# Altium schematic sheet cpu.SchDoc
size A4
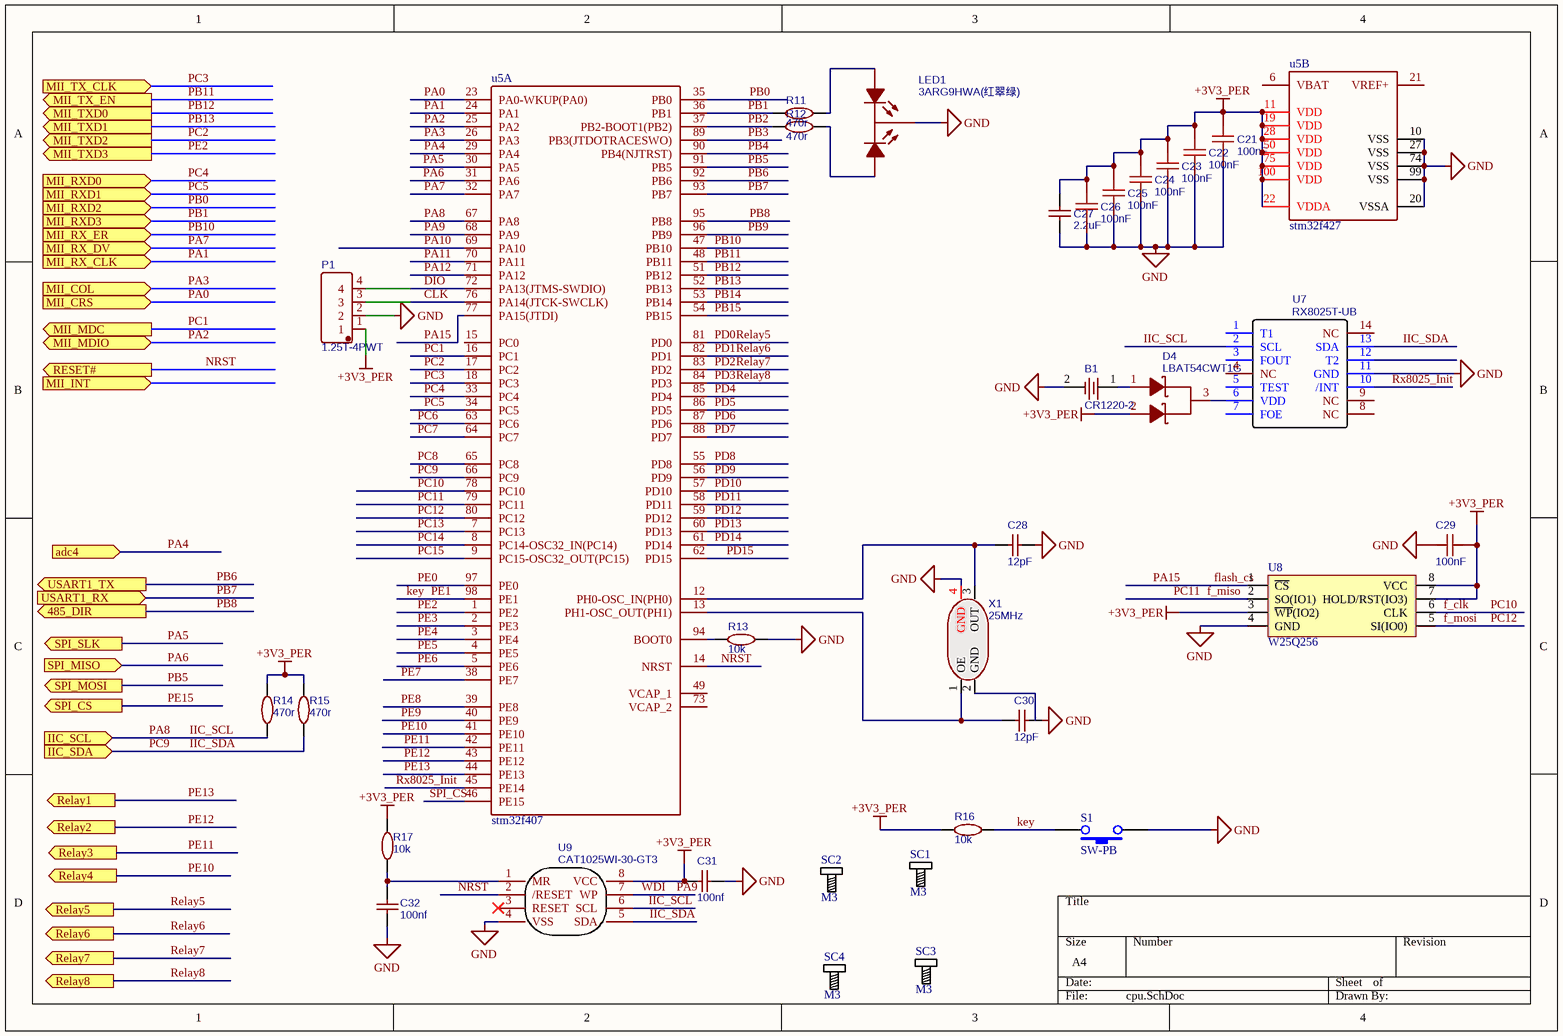
[diagram p0: cpu.SchDoc]

## Parts
B1  CR1220-2  [BATTERY-2]
C21  100nF  [0603 - cap]
C22  100nF  [0603 - cap]
C23  100nF  [0603 - cap]
C24  100nF  [0603 - cap]
C25  100nF  [0603 - cap]
C26  100nF  [0603 - cap]
C27  2.2uF  [1206 - cap]
C28  12pF  [0603 - cap]
C29  100nF  [0603 - cap]
C30  12pF  [0603 - cap]
C31  100nf  [0603 - cap]
C32  100nf  [0603 - cap]
D4  LBAT54CWT1G  [SC-70(SC-70-3)]
LED1  3ARG9HWA(红翠绿)  [led3]
P1  1.25T-4PWT  [1.25T-4PWT]
R11  470r  [0603-res]
R12  470r  [0603-res]
R13  10k  [0603-res]
R14  470r  [0603-res]
R15  470r  [0603-res]
R16  10k  [0603-res]
R17  10k  [0603-res]
S1  SW-PB  [HYA45513]
SC1  M3  [安装孔(3mm)]
SC2  M3  [安装孔(3mm)]
SC3  M3  [安装孔(3mm)]
SC4  M3  [安装孔(3mm)]
u5  stm32f407  [LQFP-100_14X14X05P]  (parts A,B of 2)
U7  RX8025T-UB  [SOP-14_208MIL]
U8  W25Q256  [LC-SOIC-8_208mil]
U9  CAT1025WI-30-GT3  [SOIC-8_150MIL]
X1  25MHz  [OSC-YSX-3225_4P]

## Ports
485_DIR (out), adc4 (in), IIC_SCL (in), IIC_SDA (in), MII_COL (in), MII_CRS (in), MII_INT (in), MII_MDC (out), MII_MDIO (bidir), MII_RX_CLK (in), MII_RX_DV (in), MII_RX_ER (in), MII_RXD0 (in), MII_RXD1 (in), MII_RXD2 (in), MII_RXD3 (in), MII_TX_CLK (in), MII_TX_EN (out), MII_TXD0 (out), MII_TXD1 (out), MII_TXD2 (out), MII_TXD3 (out), Relay1 (out), Relay2 (out), Relay3 (out), Relay4 (out), Relay5 (out), Relay6 (out), Relay7 (out), Relay8 (out), RESET# (out), SPI_CS (out), SPI_MISO (in), SPI_MOSI (out), SPI_SLK (out), USART1_RX (in), USART1_TX (out)

## Nets
+3V3_PER: C21.2 C22.2 C23.2 C24.2 C25.2 C26.2 C27.2 C29.1 C31.1 D4.2(K2) P1.1 R14.2 R15.2 R16.1 R17.2 u5.11(VDD) u5.19(VDD) u5.22(VDDA) u5.28(VDD) u5.50(VDD) u5.75(VDD) u5.100(VDD) U8.3(~{WP}(IO2)) U8.7(HOLD/RST(IO3)) U8.8(VCC) U9.8(VCC)
GND: B1.2 C21.1 C22.1 C23.1 C24.1 C25.1 C26.1 C27.1 C28.1 C29.2 C30.1 C31.2 C32.2 LED1.3(K) P1.2 R13.1 S1.1 u5.10(VSS) u5.20(VSSA) u5.27(VSS) u5.74(VSS) u5.99(VSS) U7.11(GND) U8.4(GND) U9.4(VSS) X1.4(GND)
CLK: P1.3 u5.76(PA14(JTCK-SWCLK))
DIO: P1.4 u5.72(PA13(JTMS-SWDIO))
f_clk: u5.78(PC10) U8.6(CLK)  [also labelled PC10]
f_miso: u5.79(PC11) U8.2(SO(IO1))  [also labelled PC11]
f_mosi: u5.80(PC12) U8.5(SI(IO0))  [also labelled PC12]
flash_cs: u5.77(PA15(JTDI)) U8.1(~{CS})  [also labelled PA15]
IIC_SCL: R14.1 u5.67(PA8) U7.2(SCL) U9.6(SCL) ; port IIC_SCL  [also labelled PA8]
IIC_SDA: R15.1 u5.66(PC9) U7.13(SDA) U9.5(SDA) ; port IIC_SDA  [also labelled PC9]
key: R16.2 S1.2 u5.98(PE1)  [also labelled PE1]
NRST: u5.14(NRST) U9.2(/RESET) ; port RESET#
PA0: u5.23(PA0-WKUP(PA0)) ; port MII_CRS
PA1: u5.24(PA1) ; port MII_RX_CLK
PA2: u5.25(PA2) ; port MII_MDIO
PA3: u5.26(PA3) ; port MII_COL
PA4: u5.29(PA4) ; port adc4
PA5: u5.30(PA5) ; port SPI_SLK
PA6: u5.31(PA6) ; port SPI_MISO
PA7: u5.32(PA7) ; port MII_RX_DV
PA9: u5.68(PA9) U9.7(WP)  [also labelled WDI]
PA10: u5.69(PA10)
PA11: u5.70(PA11)
PA12: u5.71(PA12)
PB0: u5.35(PB0) ; port MII_RXD2
PB1: R11.2 u5.36(PB1) ; port MII_RXD3
PB2: R12.2 u5.37(PB2-BOOT1(PB2))
PB3: u5.89(PB3(JTDOTRACESWO))
PB4: u5.90(PB4(NJTRST))
PB5: u5.91(PB5) ; port SPI_MOSI
PB6: u5.92(PB6) ; port USART1_TX
PB7: u5.93(PB7) ; port USART1_RX
PB8: u5.95(PB8) ; port 485_DIR
PB9: u5.96(PB9)
PB10: u5.47(PB10) ; port MII_RX_ER
PB11: u5.48(PB11) ; port MII_TX_EN
PB12: u5.51(PB12) ; port MII_TXD0
PB13: u5.52(PB13) ; port MII_TXD1
PB14: u5.53(PB14)
PB15: u5.54(PB15)
PC1: u5.16(PC1) ; port MII_MDC
PC2: u5.17(PC2) ; port MII_TXD2
PC3: u5.18(PC3) ; port MII_TX_CLK
PC4: u5.33(PC4) ; port MII_RXD0
PC5: u5.34(PC5) ; port MII_RXD1
PC6: u5.63(PC6)
PC7: u5.64(PC7)
PC8: u5.65(PC8)
PC13: u5.7(PC13)
PC14: u5.8(PC14-OSC32_IN(PC14))
PC15: u5.9(PC15-OSC32_OUT(PC15))
PD0: u5.81(PD0) ; port Relay5  [also labelled Relay5]
PD1: u5.82(PD1) ; port Relay6  [also labelled Relay6]
PD2: u5.83(PD2) ; port Relay7  [also labelled Relay7]
PD3: u5.84(PD3) ; port Relay8  [also labelled Relay8]
PD4: u5.85(PD4)
PD5: u5.86(PD5)
PD6: u5.87(PD6)
PD7: u5.88(PD7)
PD8: u5.55(PD8)
PD9: u5.56(PD9)
PD10: u5.57(PD10)
PD11: u5.58(PD11)
PD12: u5.59(PD12)
PD13: u5.60(PD13)
PD14: u5.61(PD14)
PD15: u5.62(PD15)
PE0: u5.97(PE0)
PE2: u5.1(PE2) ; port MII_TXD3
PE3: u5.2(PE3)
PE4: u5.3(PE4)
PE5: u5.4(PE5)
PE6: u5.5(PE6)
PE7: u5.38(PE7)
PE8: u5.39(PE8)
PE9: u5.40(PE9)
PE10: u5.41(PE10) ; port Relay4
PE11: u5.42(PE11) ; port Relay3
PE12: u5.43(PE12) ; port Relay2
PE13: u5.44(PE13) ; port Relay1
PE15: port SPI_CS
Rx8025_Init: u5.45(PE14) U7.10(/INT)
SPI_CS: u5.46(PE15)
NetB1_1: B1.1 D4.1(K1)
NetC28_2: C28.2 u5.12(PH0-OSC_IN(PH0)) X1.3(OUT)
NetC30_2: C30.2 u5.13(PH1-OSC_OUT(PH1)) X1.1(OE)
NetC32_1: C32.1 R17.1 U9.1(MR)
NetD4_3: D4.3(A) U7.6(VDD)
NetLED1_1: LED1.1(A1) R11.1
NetLED1_2: LED1.2(A2) R12.1
NetR13_2: R13.2 u5.94(BOOT0)

Not connected (* = marked no-connect by the designer): u5 6(VBAT) 15(PC0) 21(VREF+) 49(VCAP_1) 73(VCAP_2); U7 1(T1) 3(FOUT) 4(NC) 5(TEST) 7(FOE) 8(NC) 9(NC) 12(T2) 14(NC); U9 3(RESET)*; X1 2(GND)

## Library data of the parts
B1 = (no symbol name): BOM_Manufacturer: Q&J; BOM_Supplier: LCSC; BOM_Manufacturer Part: CR1220-2; BOM_LCSC: C70381; image: //image.lceda.cn/szlcsc/C70381.jpg; spicePre: B
C21-C26 C29 = (no symbol name): BOM_Manufacturer: YAGEO; BOM_Manufacturer Part: CC0603KRX7R9BB104; nameAlias: Capacitance; BOM_Supplier: LCSC; BOM_LCSC: C14663; BOM_LCSC Assembly: Yes; spicePre: C; spiceSymbolName: CC0603KRX7R9BB104
C27 = (no symbol name): BOM_Manufacturer Part: CL31B225KBHNNNE; BOM_Manufacturer: SAMSUNG; nameAlias: Capacitance; BOM_Supplier: LCSC; BOM_LCSC: C50254; BOM_LCSC Assembly: Yes; spicePre: C; spiceSymbolName: CL31B225KBHNNNE
C28 C30-C32 = (no symbol name): BOM_Manufacturer Part: CL10C120JB8NNNC; BOM_Manufacturer: SAMSUNG; nameAlias: Capacitance; BOM_Supplier: LCSC; BOM_LCSC: C38523; BOM_LCSC Assembly: Yes; spicePre: C; spiceSymbolName: CL10C120JB8NNNC
D4 = (no symbol name): BOM_Manufacturer: LRC; BOM_Supplier: LCSC; BOM_Manufacturer Part: LBAT54CWT1G; BOM_LCSC: C57891; image: //image.lceda.cn/szlcsc/C57891.jpg; spicePre: D
LED1 = (no symbol name): BOM_Manufacturer: KENTO; BOM_Supplier: LCSC; BOM_Manufacturer Part: 3ARG9HWA(红翠绿); BOM_LCSC: C72701; spicePre: L
P1 = (no symbol name): BOM_Manufacturer: BOOMELE; spicePre: X; BOM_Supplier: LCSC; BOM_LCSC: C31597; BOM_Manufacturer Part: 1.25T-4PWT
R11-R17 = (no symbol name): BOM_Manufacturer: UniOhm; BOM_Manufacturer Part: 0603WAF1001T5E; nameAlias: Value; BOM_Supplier: LCSC; BOM_LCSC: C21190; BOM_LCSC Assembly: Yes; spicePre: R; spiceSymbolName: 0603WAF1001T5E
S1 = SW-PB: 微型按键开关
SC1-SC4 = Screw_M3: Screw
u5 = stm32f427
U7 = (no symbol name): BOM_Manufacturer: EPSON; BOM_Supplier: LCSC; BOM_Manufacturer Part: RX8025T-UB; BOM_LCSC: C17353; image: //image.lceda.cn/szlcsc/C17353.jpg; spicePre: U
U8 = W25Q128
U9 = (no symbol name): BOM_Manufacturer: ON; BOM_Supplier: LCSC; BOM_Manufacturer Part: CAT1025WI-30-GT3; BOM_LCSC: C30752; image: //image.lceda.cn/szlcsc/C30752.jpg; spicePre: U
X1 = (no symbol name): BOM_Manufacturer: YXC; BOM_Manufacturer Part: X322525MOB4SI; nameAlias: Frequency; BOM_Supplier: LCSC; BOM_LCSC: C9006; BOM_LCSC Assembly: Yes; spicePre: X; spiceSymbolName: X322525MOB4SI